# Altium schematic sheet LP2951.SchDoc
size 431 x 279 mm; Date: Not shown in title block; ApprovedBy: Not shown in title block; CheckedBy: Not shown in title block; Author: Not shown in title block; CompanyName: Not shown in title block; DrawnBy: Andy Lin (TI); Engineer: Not shown in title block; Organization: Not shown in title block; Address1: Not shown in title block; Address2: Not shown in title block; Address3: Not shown in title block; Address4: Not shown in title block; DocumentNumber: 9; Revision: Use project parameter SCH_Rev; SheetNumber: 9; SheetTotal: 14; PageSetup: Record=PageOptions|CenterHorizontal=True|CenterVertical=True|PrintScale=1.00|XCorrection=1.00|YCorrection=1.00|PrintKind=0|BorderSize=5000000|LeftOffset=0|BottomOffset=0|Orientation=2|PaperLength=1000|PaperWidth=1000|Scale=100|PaperSource=15|PrintQuality=600|MediaType=1|DitherType=10|PaperKind=Letter|PrintScaleMode=1; CurrentTime: Not shown in title block; CurrentDate: Not shown in title block; Time: Not shown in title block; DocumentFullPathAndName: Not shown in title block; DocumentName: Not shown in title block; ModifiedDate: Not shown in title block; ImagePath: Not shown in title block
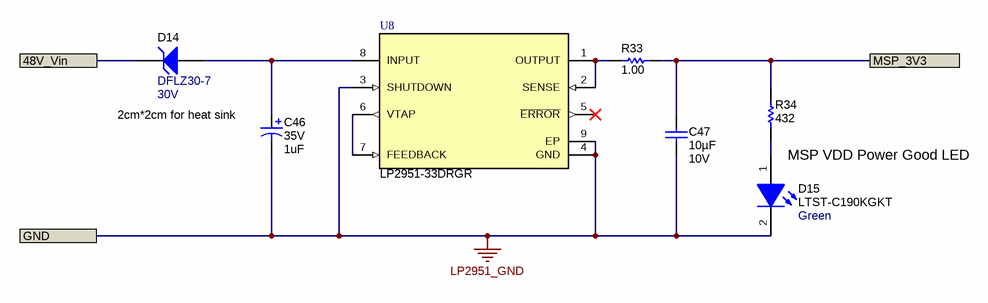
[diagram p0: LP2951.SchDoc]

## Parts
C46  VDC_V: 35V  ValueDisplayed: 1uF  [3528-21]  (hidden comment: 293D105X9035B2TE3)
C47  Cap_F: 10µF  VDC_V: 10V  [0603]  (hidden comment: GRM188Z71A106MA73D)
D14  DFLZ30-7  value 30V  [PowerDI123]
D15  LTST-C190KGKT  value Green  [LED_LTST-C190_G]
R33  ValueDisplayed: 1.00  [0603]  (hidden comment: CRCW06031R00FKEA)
R34  ValueDisplayed: 432  [0603]  (hidden comment: CRCW0603432RFKEA)
U8  LP2951-33DRGR  [DRG0008A]

## Ports
48V_Vin, GND, MSP_3V3

## Nets
LP2951_GND: C46.2(-) C47.2 D15.2(K) U8.3(SHUTDOWN) U8.4(GND) U8.9(EP) ; port GND
48V_Vin: D14.1(K) ; port 48V_Vin
MSP_3V3: C47.1 R33.1 R34.2 ; port MSP_3V3
NetC46_1: C46.1(+) D14.2(A) U8.8(INPUT)
NetD15_1: D15.1(A) R34.1
NetR33_2: R33.2 U8.1(OUTPUT) U8.2(SENSE)
NetU8_6: U8.6(VTAP) U8.7(FEEDBACK)

Not connected (* = marked no-connect by the designer): U8 5(~{ERROR})*

## Notes on the sheet
- 2cm*2cm for heat sink
- MSP VDD Power Good LED
- Drawn By:
- SVN Rev:
- Number:
- TID #:
- Orderable:
- Rev:
- Sheet Title:
- File:
- Project Title:
- Designed for:
- Assembly Variant:
- Mod. Date:
- Sheet:
- Size:
- of
- B
- http://www.ti.com
- Texas Instruments and/or its licensors do not warrant the accuracy or completeness of this specification or any information contained therein. Texas Instruments and/or its licensors do not warrant that this design will meet the specifications, will be suitable for your application or fit for any particular purpose, or will operate in an implementation. Texas Instruments and/or its licensors do not warrant that the design is production worthy. You should completely validate and test your design implementation to confirm the system functionality for your application.
- Engineer:
- Contact:
- © Texas Instruments

## Library data of the parts
C46 = CMP-0011509-2: CAP, TA, 1 uF, 35 V, +/- 10%, 5 ohm, SMD; Manufacturer: Vishay-Sprague; TaMin_C: -55°C; ESR_ohm: 5; Polarized: Y; SizeAreaWB_mm2: 17.1; Value1: 5 ohm; U/M: EA; Value: 1uF; TaMax_C: 125°C; SizeZ_mm: 2.1; SizeX_mm: 3.5; SizeY_mm: 2.8; Cap_Case: B; SizeArea_mm2: 9.8; CompType: Capacitor; Cap_F: 1µF; IRMS_A: 130mA; AEC Category: Q200; Supplier Part Number 2: 74-293D105X9035B2TE3; Publisher: Texas Instruments; Supplier 2: Mouser; Supplier Part Number 3: 1754225; Supplier 3: Farnell; RoHS: Y; MountType: SMT; Supplier 1: Digi-Key; LatestRevisionNote: Updated supplier links; PackageReference: 3528-21; Tolerance_%: 10%; Value2: 35V; LatestRevisionDate: 2017-03-09; PartNumber: 293D105X9035B2TE3; AEC Qualified: ?; Series: 293D; ComponentLink1Description: Datasheet link; Supplier Part Number 1: 718-1117-1-ND; Technology: TA; ComponentLink1URL: http://www.vishay.com/docs/40002/293d.pdf
C47 = CMP-0007497-5: CAP, CERM, 10 uF, 10 V, +/- 20%, X7R, 0603; Manufacturer: MuRata; TaMin_C: -55°C; Polarized: N; SizeAreaWB_mm2: 4.68; Value1: Unknown; U/M: EA; Value: 10uF; TaMax_C: 125°C; SizeZ_mm: 1; SizeX_mm: 1.6; SizeY_mm: 0.8; SizeArea_mm2: 1.28; AEC Category: Q200; Publisher: Texas Instruments; TempCo: X7R; Published: 2008-06-19; RoHS: Y; MountType: SMT; Supplier 1: Mouser; PackageReference: 0603; Tolerance_%: 20%; Cap_Case: 0603; Value2: 10V; CompType: Capacitor; LatestRevisionDate: 2017-03-09; PartNumber: GRM188Z71A106MA73D; AEC Qualified: N; ComponentLink1Description: Datasheet link; AEC Grade: N/A; Supplier Part Number 1: 81-GRM188Z71A106MA3D; Technology: Ceramic; ValueDisplayed: 10uF; ComponentLink1URL: http://psearch.en.murata.com/capacitor/product/GRM188Z71A106MA73%23.pdf
D14 = CMP-0005417-4: Diode, Zener, 30 V, 1 W, PowerDI123; Manufacturer: Diodes Inc.; SizeX_mm: 3.7; Power_W: 1W; SizeY_mm: 1.78; AEC Category: Q101; RJA_CperW: 110; SizeArea_mm2: 6.586; SizeZ_mm: 0.98; SizeAreaWB_mm2: 13.066; AEC Qualified: ?; ComponentLink1Description: Datasheet link; MountType: SMT; Vz_V: 30V; Value1: 1W; ComponentLink1URL: http://www.diodes.com/datasheets/ds30464.pdf; PartNumber: DFLZ30-7; CompType: Zener; PackageReference: PowerDI123; RoHS: Y
D15 = CMP-0002840-2: LED, Green, SMD; Manufacturer: Lite-On; Value1: W; Io_A: 30mA; Value2: 2V; Tjmax_C: 85°C; Type: AlInGaP; PartNumber: LTST-C190KGKT; MountType: SMT; CompType: LED; Color: green; ComponentLink1Description: Datasheet link; RoHS: Y; ComponentLink1URL: http://optoelectronics.liteon.com/en-us/api/DwonloadFileHandler.ashx?txtSpecNo=DS22-2000-074&txtPartNo=LTST-C190KGKT; Vf_V: 2V; PackageReference: 1.6x0.8x0.8mm
R33 = CMP-0022170-1: RES, 1.00, 1%, 0.1 W, 0603; Manufacturer: Vishay-Dale; Power_W: 100mW; TempCo: 100 ppm/C; Value_Code: 1R00; U/M: EA; Value: 1.00; EIA_Code: E96; Res_ohm: 1; SizeX_mm: 1.6; SizeY_mm: 0.8; Value2: 0.1W; SizeArea_mm2: 1.28; VDC_V: 75V; AEC Category: Q200; ComponentLink1URL: http://www.vishay.com/docs/20035/dcrcwe3.pdf; Supplier Part Number 2: 71-CRCW06031R00FKEA; Publisher: Texas Instruments; Supplier 2: Mouser; Supplier Part Number 3: 1616871; Supplier 3: Farnell; Published: 2008-06-26; RoHS: Y; Value1: 1%; MountType: SMT; Supplier 1: Newark; PackageReference: 0603; Tolerance_%: 1%; SizeZ_mm: 1; CompType: Resistor; LatestRevisionDate: 2017-03-09; PartNumber: CRCW06031R00FKEA; AEC Qualified: ?; ComponentLink1Description: Datasheet link; Supplier Part Number 1: 52K8059; Technology: Thick Film
R34 = CMP-0022421-5: RES, 432, 1%, 0.1 W, AEC-Q200 Grade 0, 0603; Manufacturer: Vishay-Dale; Power_W: 100mW; TempCo: 100 ppm/C; Value_Code: 432R; Value: 432; EIA_Code: E96; SizeX_mm: 1.6; SizeY_mm: 0.8; SizeZ_mm: 1; Value2: 0.1W; SizeArea_mm2: 1.28; AEC Qualified: Y; VDC_V: 75V; AEC Category: Q200; AEC Grade: 0; Supplier Part Number 2: 52K8531; Supplier 2: Newark; Supplier Part Number 3: 71-CRCW0603-432-E3; Supplier 3: Mouser; RoHS: E; Value1: 1%; MountType: SMT; Supplier 1: Digi-Key; PackageReference: 0603; Tolerance_%: 1%; Res_ohm: 432; CompType: Resistor; PartNumber: CRCW0603432RFKEA; ComponentLink1Description: Datasheet link; Supplier Part Number 1: 541-432HCT-ND; Technology: Thick Film; ComponentLink1URL: http://www.vishay.com/docs/20035/dcrcwe3.pdf
U8 = CMP-0036258-1: Single Output LDO, 100 mA, Fixed 3.3 V Output, 3.7 to 30 V Input, -40 to 125 degC, 8-Pin SON (DRG), RoHS, Tape and Reel; Manufacturer: Texas Instruments; Fixed Output Options (V): 3.3; Iout (Max) (A): 0.1; Rating: Catalog; Vout (Max) (V): 3.333; Vin (Max) (V): 30; Vdo (Typ) (mV): 380; Iq (Typ) (mA): 0.075; Accuracy (%): 1.4; Vin (Min) (V): 3.7; Output Capacitor Type: Non-Ceramic; Vout (Min) (V): 3.267; Output Options: Fixed Output; PackageReference: DRG0008A; ComponentLink2Description: Datasheet; PackageVersion: 4205379/C; ComponentLink3Description: Package Specification; Packing: Tape and Reel; RoHS: TRUE; ComponentLink1URL: http://www.ti.com/; Mounting Technology: Surface Mount; Operating Temperature Range (C): -40 to 125; ComponentLink2URL: http://www.ti.com/lit/ds/symlink/lp2950-30.pdf; DatasheetVersion: SLVS582H; ComponentLink3URL: http://www.ti.com/lit/ml/mpds151b/mpds151b.pdf; ComponentLink1Description: Manufacturer URL; PackageDescription: 8-Pin Plastic Small Outline No-Lead, Body 3 x 3 mm, Pitch 0.5 mm; PartNumber: LP2951-33DRGR